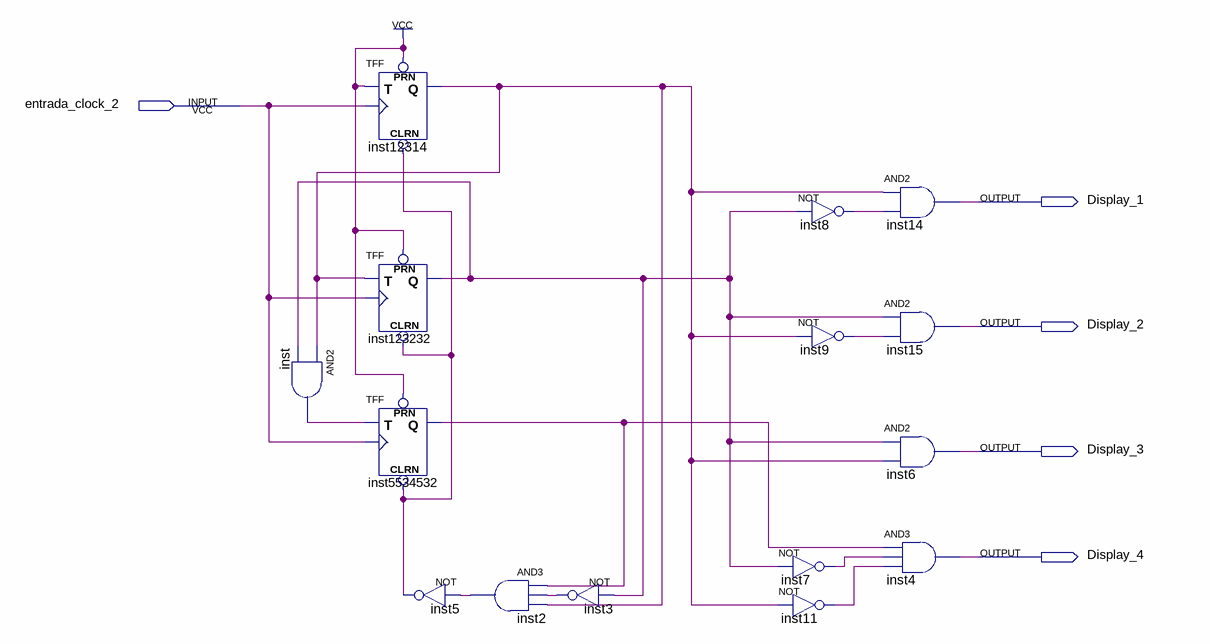
[diagram p0: schematic sheet]
// Quartus schematic Display.bdf as structural Verilog: 15 symbols, 5 pins
module Display (
  input  entrada_clock_2,
  output Display_1,
  output Display_2,
  output Display_3,
  output Display_4
);

  wire inst2_out, inst3_out, inst5_out, inst7_out, inst8_out, inst9_out, inst11_out, inst12314_q,
       inst123232_q, inst5534532_q, inst_out;

  and inst (inst_out, inst12314_q, inst123232_q);
  TFF inst12314 (.PRN(1'b1), .CLRN(inst5_out), .T(1'b1), .CLK(entrada_clock_2), .Q(inst12314_q));
  TFF inst123232 (.PRN(1'b1), .CLRN(inst5_out), .T(inst12314_q), .CLK(entrada_clock_2), .Q(inst123232_q));
  TFF inst5534532 (.PRN(1'b1), .CLRN(inst5_out), .T(inst_out), .CLK(entrada_clock_2), .Q(inst5534532_q));
  not inst5 (inst5_out, inst2_out);
  and inst2 (inst2_out, inst5534532_q, inst3_out, inst12314_q);
  not inst3 (inst3_out, inst123232_q);
  not inst8 (inst8_out, inst123232_q);
  not inst9 (inst9_out, inst12314_q);
  not inst7 (inst7_out, inst123232_q);
  not inst11 (inst11_out, inst12314_q);
  and inst14 (Display_1, inst12314_q, inst8_out);
  and inst15 (Display_2, inst123232_q, inst9_out);
  and inst6 (Display_3, inst123232_q, inst12314_q);
  and inst4 (Display_4, inst5534532_q, inst7_out, inst11_out);
endmodule
